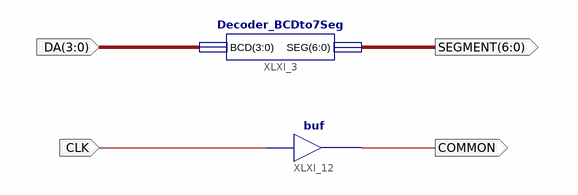
[diagram p0: schematic sheet 1]
// Xilinx ISE schematic top_level.sch (spartan6) as structural Verilog: 2 symbols, 4 ports
module top_level (
  input  [3:0] DA,
  input  CLK,
  output [6:0] SEGMENT,
  output COMMON
);

  Decoder_BCDto7Seg XLXI_3 (.BCD(DA), .SEG(SEGMENT));
  buf XLXI_12 (COMMON, CLK);
endmodule
